# Altium schematic sheet Communication.SchDoc
size A4
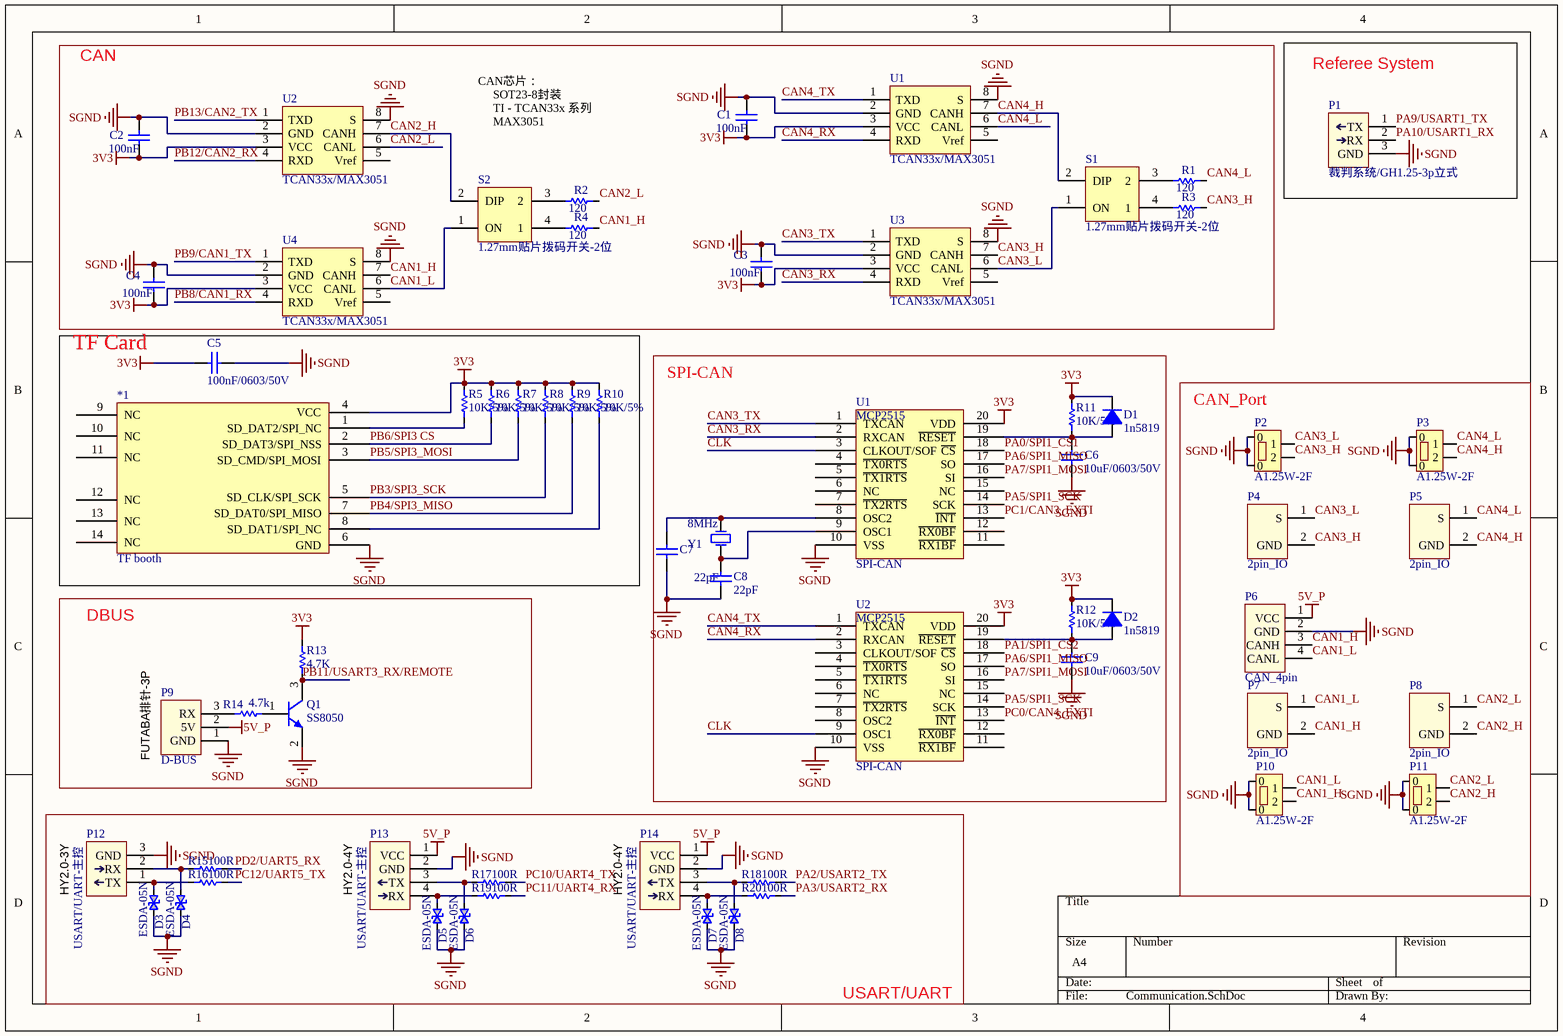
[diagram p0: Communication.SchDoc]

## Parts
(Parts that share a designator on the sheet are numbered #1, #2 ... from top to bottom, then left to right.)
*1  TF booth  [tf_booth]
C1  100nF  [0603C]
C2  100nF  [0603C]
C3  100nF  [0603C]
C4  100nF  [0603C]
C5  100nF/0603/50V  [0603C]
C6  10uF/0603/50V  [0603C]
C7  22pF  [0603C]
C8  22pF  [0603C]
C9  10uF/0603/50V  [0603C]
D1  1n5819  [SOD-323-]
D2  1n5819  [SOD-323-]
D3  ESDA-05N  [0603ESDA]
D4  ESDA-05N  [0603ESDA]
D5  ESDA-05N  [0603ESDA]
D6  ESDA-05N  [0603ESDA]
D7  ESDA-05N  [0603ESDA]
D8  ESDA-05N  [0603ESDA]
P1  裁判系统/GH1.25-3p立式  [A1254-03AWB]
P2  A1.25W-2F  [GH1.25-2P-立贴]
P3  A1.25W-2F  [GH1.25-2P-立贴]
P4  2pin_IO  [HY2.00MM 2X1_立式]
P5  2pin_IO  [HY2.00MM 2X1_立式]
P6  CAN_4pin  [HY2.00MM 4X1立式]
P7  2pin_IO  [HY2.00MM 2X1_立式]
P8  2pin_IO  [HY2.00MM 2X1_立式]
P9  D-BUS  [HY2.00MM 3x1立式]
P10  A1.25W-2F  [GH1.25-2P-立贴]
P11  A1.25W-2F  [GH1.25-2P-立贴]
P12  USART/UART-主控  [HY2.00MM 3x1立式]
P13  USART/UART-主控  [HY2.00MM 4X1立式]
P14  USART/UART-主控  [HY2.00MM 4X1立式]
Q1  SS8050  [SOT-23-3]
R1  120  [0603R]
R2  120  [0603R]
R3  120  [0603R]
R4  120  [0603R]
R5  10K/5%  [0603R]
R6  10K/5%  [0603R]
R7  10K/5%  [0603R]
R8  10K/5%  [0603R]
R9  10K/5%  [0603R]
R10  10K/5%  [0603R]
R11  10K/5%  [0603R]
R12  10K/5%  [0603R]
R13  4.7K  [0603R]
R14  4.7k  [0603R]
R15  100R  [0603R]
R16  100R  [0603R]
R17  100R  [0603R]
R18  100R  [0603R]
R19  100R  [0603R]
R20  100R  [0603R]
S1  1.27mm贴片拨码开关-2位  [SW_DIP_2x2]
S2  1.27mm贴片拨码开关-2位  [SW_DIP_2x2]
U1#1  TCAN33x/MAX3051  [SOT-23-8]
U1#2  SPI-CAN  [TSSOP20]
U2#1  TCAN33x/MAX3051  [SOT-23-8]
U2#2  SPI-CAN  [TSSOP20]
U3  TCAN33x/MAX3051  [SOT-23-8]
U4  TCAN33x/MAX3051  [SOT-23-8]
Y1  8MHz  [NX3225GD]

## Blocks framed on the sheet
CAN: C1-C4 R1-R4 S1 S2 U1#1 U2#1 U3 U4
Referee System: P1
TF Card: *1 C5 R5-R10
SPI-CAN: C6-C9 D1 D2 R11 R12 U1#2 U2#2 Y1
CAN_Port: P2-P8 P10 P11
DBUS: P9 Q1 R13 R14
USART/UART: D3-D8 P12-P14 R15-R20

## Nets
3V3: *1.4(VCC) C1.1 C2.1 C3.1 C4.1 C5.2 D1.2(K) D2.2(K) R5.2 R6.2 R7.2 R8.2 R9.2 R10.2 R11.2 R12.2 R13.2 U1#1.3(VCC) U1#2.20(VDD) U2#1.3(VCC) U2#2.20(VDD) U3.3(VCC) U4.3(VCC)
5V_P: P6.1(VCC) P9.2(5V) P13.1(VCC) P14.1(VCC)
SGND: *1.6(GND) C1.2 C2.2 C3.2 C4.2 C5.1 C6.1 C7.1 C8.1 C9.1 D3.1(V) D4.1(V) D5.1(V) D6.1(V) D7.1(V) D8.1(V) P1.3(GND) P2.0 P3.0 P6.2(GND) P9.1(GND) P10.0 P11.0 P12.3(GND) P13.2(GND) P14.2(GND) Q1.2(E) U1#1.2(GND) U1#1.8(S) U1#2.10(VSS) U2#1.2(GND) U2#1.8(S) U2#2.10(VSS) U3.2(GND) U3.8(S) U4.2(GND) U4.8(S)
CAN1_H: P6.3(CANH) P7.2(GND) P10.2 R4.1 U4.7(CANH)
CAN1_L: P6.4(CANL) P7.1(S) P10.1 S2.1(ON) U4.6(CANL)
CAN2_H: P8.2(GND) P11.2 S2.2(DIP) U2#1.7(CANH)
CAN2_L: P8.1(S) P11.1 R2.1 U2#1.6(CANL)
CAN3_H: P2.2 P4.2(GND) R3.1 U3.7(CANH)
CAN3_L: P2.1 P4.1(S) S1.1(ON) U3.6(CANL)
CAN3_RX: U1#2.2(RXCAN) U3.4(RXD)
CAN3_TX: U1#2.1(TXCAN) U3.1(TXD)
CAN4_H: P3.2 P5.2(GND) S1.2(DIP) U1#1.7(CANH)
CAN4_L: P3.1 P5.1(S) R1.1 U1#1.6(CANL)
CAN4_RX: U1#1.4(RXD) U2#2.2(RXCAN)
CAN4_TX: U1#1.1(TXD) U2#2.1(TXCAN)
CLK: U1#2.3(CLKOUT/SOF) U2#2.9(OSC1)
PA0/SPI1_CS1: U1#2.18(~{CS})
PA1/SPI1_CS2: U2#2.18(~{CS})
PA2/USART2_TX: R18.2
PA3/USART2_RX: R20.2
PA5/SPI1_SCK: U1#2.14(SCK) U2#2.14(SCK)
PA6/SPI1_MISO: U1#2.17(SO) U2#2.17(SO)
PA7/SPI1_MOSI: U1#2.16(SI) U2#2.16(SI)
PA9/USART1_TX: P1.1(TX)
PA10/USART1_RX: P1.2(RX)
PB3/SPI3_SCK: *1.5(SD_CLK/SPI_SCK) R8.1
PB4/SPI3_MISO: *1.7(SD_DAT0/SPI_MISO) R9.1
PB5/SPI3_MOSI: *1.3(SD_CMD/SPI_MOSI) R7.1
PB6/SPI3 CS: *1.2(SD_DAT3/SPI_NSS) R6.1
PB8/CAN1_RX: U4.4(RXD)
PB9/CAN1_TX: U4.1(TXD)
PB11/USART3_RX/REMOTE: Q1.3(C) R13.1
PB12/CAN2_RX: U2#1.4(RXD)
PB13/CAN2_TX: U2#1.1(TXD)
PC0/CAN4_EXTI: U2#2.13(~{INT})
PC1/CAN3_EXTI: U1#2.13(~{INT})
PC10/UART4_TX: R17.2
PC11/UART4_RX: R19.2
PC12/UART5_TX: R16.2
PD2/UART5_RX: R15.2
Net*1_1: *1.1(SD_DAT2/SPI_NC) R5.1
Net*1_8: *1.8(SD_DAT1/SPI_NC) R10.1
NetC6_2: C6.2 D1.1(A) R11.1 U1#2.19(~{RESET})
NetC7_2: C7.2 U1#2.8(OSC2) Y1.2(OSC2)
NetC8_2: C8.2 U1#2.9(OSC1) Y1.1(OSC1)
NetC9_2: C9.2 D2.1(A) R12.1 U2#2.19(~{RESET})
NetD3_2: D3.2(G) P12.1(TX) R16.1
NetD4_2: D4.2(G) P12.2(RX) R15.1
NetD5_2: D5.2(G) P13.4(RX) R19.1
NetD6_2: D6.2(G) P13.3(TX) R17.1
NetD7_2: D7.2(G) P14.4(RX) R20.1
NetD8_2: D8.2(G) P14.3(TX) R18.1
NetP9_3: P9.3(RX) R14.1
NetQ1_1: Q1.1(B) R14.2
NetR1_2: R1.2 S1.3(2)
NetR2_2: R2.2 S2.3(2)
NetR3_2: R3.2 S1.4(1)
NetR4_2: R4.2 S2.4(1)

Not connected (* = marked no-connect by the designer): *1 9(NC) 10(NC) 11(NC) 12(NC) 13(NC) 14(NC); U1#1 5(Vref); U1#2 4(~{TX0RTS}) 5(~{TX1RTS}) 6(NC) 7(~{TX2RTS}) 11(~{RX1BF}) 12(~{RX0BF}) 15(NC); U2#1 5(Vref); U2#2 3(CLKOUT/SOF) 4(~{TX0RTS}) 5(~{TX1RTS}) 6(NC) 7(~{TX2RTS}) 8(OSC2) 11(~{RX1BF}) 12(~{RX0BF}) 15(NC); U3 5(Vref); U4 5(Vref)

## Notes on the sheet
- CAN芯片：
  SOT23-8封装
  TI - TCAN33x 系列
  MAX3051
- (near P9) FUTABA排针-3P
- HY2.0-3Y
- HY2.0-4Y

## Library data of the parts
C1-C9 = Cap: Capacitor; Value: 100pF; Published: 8-Jun-2000; LatestRevisionDate: 17-Jul-2002; LatestRevisionNote: Re-released for DXP Platform.; PackageReference: RAD-0.3; Publisher: Altium Limited; PackageDescription: Radial Cap, Thru-Hole; 2 Leads; 0.3 in Pin Spacing
D1 D2 = Diode: Default Diode; Published: 8-Jun-2000; LatestRevisionDate: 17-Jul-2002; LatestRevisionNote: Re-released for DXP Platform.; PackageVersion: Sep-1996; PackageReference: SMC; Publisher: Altium Limited; PackageDescription: DO-214-AB/SMC; 2 C-Bend Leads; Body 7.9 x 5.9 mm, inc. leads (LxW); Code_JEDEC: DO-214-AB
D3-D8 = ESDA
P1 = UART_3pin
P2 P3 P10 P11 = GH1.25-2P
P6 = CAN_4pin: CAN 4pin，带5V电源，HY2.0-4A
P12 = UART_3pin_主控: Reference: UART_3pin_主控
P13 P14 = UART_4pin_主控: 带电源串口
Q1 = NPN: NPN Bipolar Transistor; Published: 8-Jun-2000; LatestRevisionDate: 17-Jul-2002; LatestRevisionNote: Re-released for DXP Platform.; PackageReference: TO-226-AA; Publisher: Altium Limited; PackageDescription: TO, Flat Index; 3 In-Line, Axial Leads; Body Dia. 4.8mm; Leads 0.55 x 0.51 mm (max); Code_JEDEC: TO-226-AA
R1-R20 = Res1: Resistor; Value: 1K; Published: 8-Jun-2000; LatestRevisionDate: 17-Jul-2002; LatestRevisionNote: Re-released for DXP Platform.; PackageReference: AXIAL-0.3; Publisher: Altium Limited; PackageDescription: Axial Device, Thru-Hole; 2 Leads; 0.3 in Pin Spacing
S1 S2 = SW_DIP 2
U1#1 U2#1 U3 U4 = CAN
U1#2 U2#2 = MCP2515
Y1 = XTAL: Crystal Oscillator; Published: 8-Jun-2000; LatestRevisionDate: 17-Jul-2002; LatestRevisionNote: Re-released for DXP Platform.; PackageReference: R38; Publisher: Altium Limited; PackageDescription: Crystal, Thru-Hole; 2 Leads; Body 3.1 x 8.2 mm (Dia.xH)